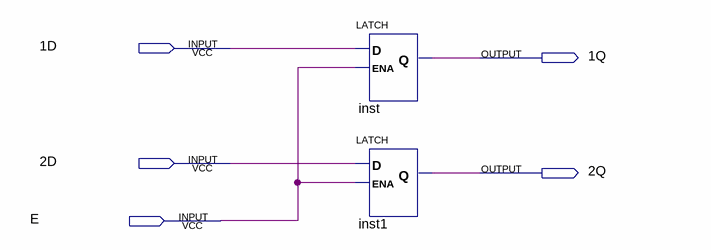
[diagram p0: schematic sheet]
// Quartus schematic 2_BIT_LATCH.bdf as structural Verilog: 2 symbols, 5 pins
module \2_BIT_LATCH  (
  input  \1D ,
  input  \2D ,
  input  E,
  output \1Q ,
  output \2Q 
);

  LATCH inst (.D(\1D ), .ENA(E), .Q(\1Q ));
  LATCH inst1 (.D(\2D ), .ENA(E), .Q(\2Q ));
endmodule
